# Altium schematic sheet [1]Shield.SchDoc
size A4; DocumentNumber: 2; SheetNumber: 2; SheetTotal: 4
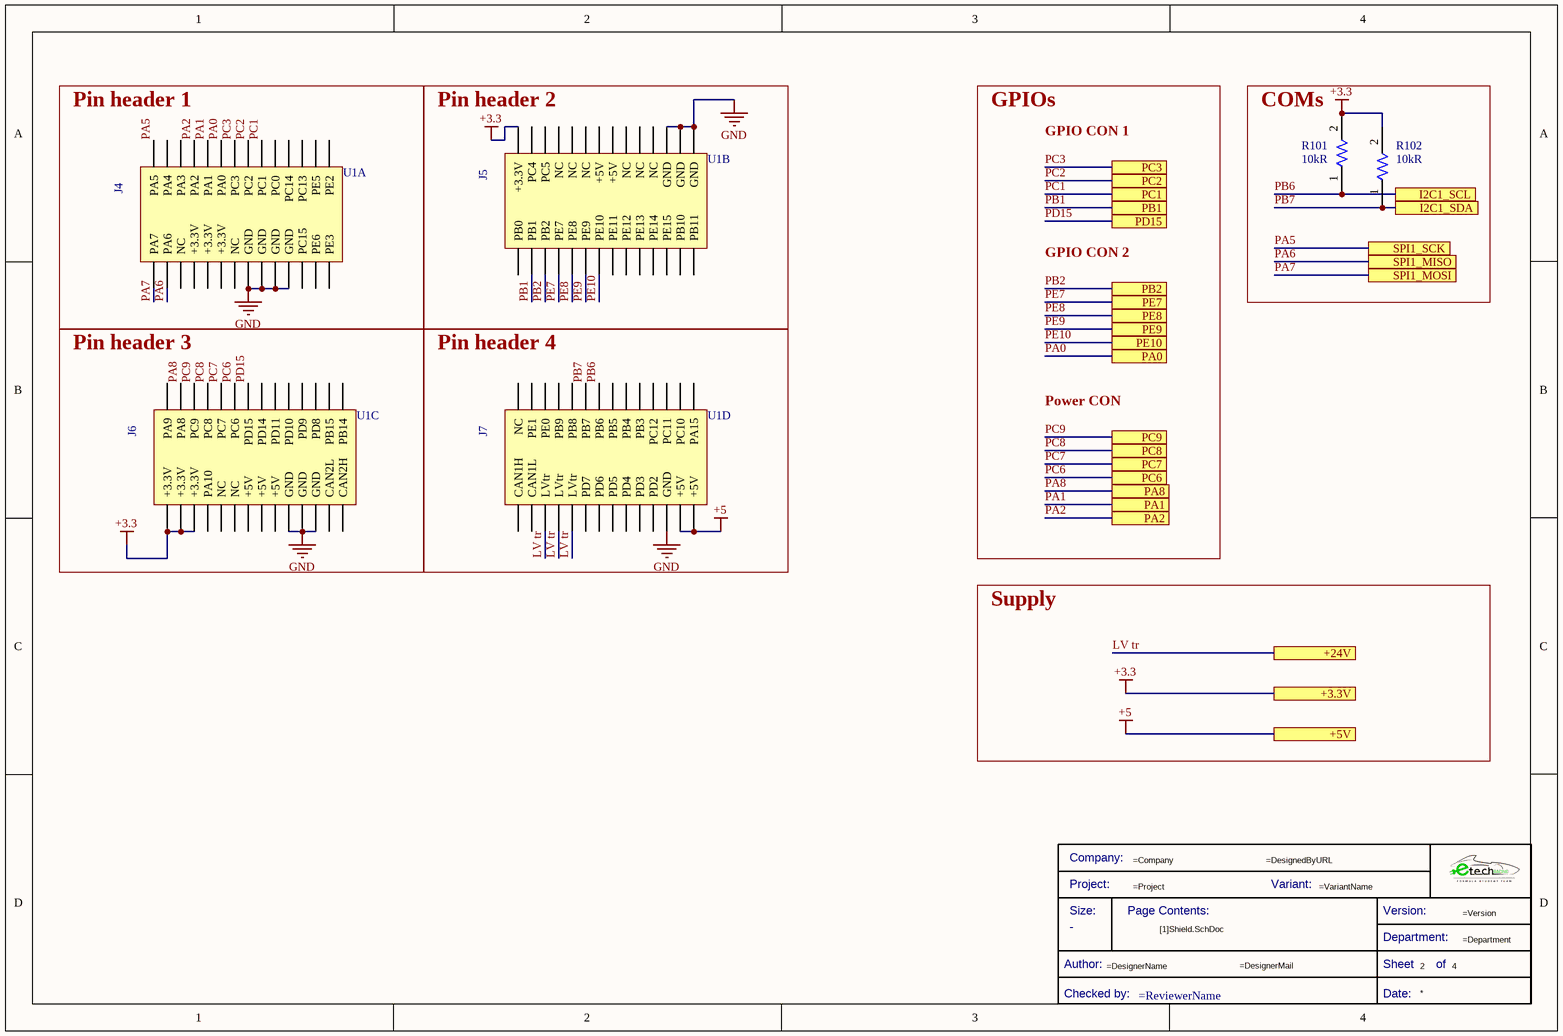
[diagram p0: [1]Shield.SchDoc]

## Parts
*  Title Block_template  (value not drawn)  (graphical)
R101  Resistance: 10kR  [R0805FTK]  (hidden comment: CR0805-JW-103ELF)
R102  Resistance: 10kR  [R0805FTK]  (hidden comment: CR0805-JW-103ELF)
U1  ETR_SHIELD_III  [ETR_SHIELD_III]  (value not drawn)  (parts A,B,C,D of 4)

## Blocks framed on the sheet
Pin header 1: U1
Pin header 2: U1
COMs: R101 R102
Pin header 3: U1
Pin header 4: U1

## Ports
+3.3V, +5V, +24V, I2C1_SCL, I2C1_SDA, PA0, PA1, PA2, PA8, PB1, PB2, PC1, PC2, PC3, PC6, PC7, PC8, PC9, PD15, PE7, PE8, PE9, PE10, SPI1_MISO, SPI1_MOSI, SPI1_SCK

## Nets
+3.3: R101.2 R102.2 U1.3V3_4(+3.3V) U1.3V3_5(+3.3V) U1.3V3_6(+3.3V) U1.3V3_7(+3.3V) ; port +3.3V
+5: U1.5V_6(+5V) U1.5V_7(+5V) ; port +5V
GND: U1.GND_1(GND) U1.GND_2(GND) U1.GND_3(GND) U1.GND_4(GND) U1.GND_5(GND) U1.GND_6(GND) U1.GND_7(GND) U1.GND_8(GND) U1.GND_9(GND) U1.GND_10(GND) U1.GND_11(GND)
LV tr: U1.LVtr_2(LVtr) U1.LVtr_3(LVtr) U1.LVtr_4(LVtr) ; port +24V
PA0: U1.PA0 ; port PA0
PA1: U1.PA1 ; port PA1
PA2: U1.PA2 ; port PA2
PA5: U1.PA5 ; port SPI1_SCK
PA6: U1.PA6 ; port SPI1_MISO
PA7: U1.PA7 ; port SPI1_MOSI
PA8: U1.PA8 ; port PA8
PB1: U1.PB1 ; port PB1
PB2: U1.PB2 ; port PB2
PB6: R101.1 U1.PB6 ; port I2C1_SCL
PB7: R102.1 U1.PB7 ; port I2C1_SDA
PC1: U1.PC1 ; port PC1
PC2: U1.PC2 ; port PC2
PC3: U1.PC3 ; port PC3
PC6: U1.PC6 ; port PC6
PC7: U1.PC7 ; port PC7
PC8: U1.PC8 ; port PC8
PC9: U1.PC9 ; port PC9
PD15: U1.PD15 ; port PD15
PE7: U1.PE7 ; port PE7
PE8: U1.PE8 ; port PE8
PE9: U1.PE9 ; port PE9
PE10: U1.PE10 ; port PE10

Not connected (* = marked no-connect by the designer): U1 3V3_1(+3.3V) 3V3_2(+3.3V) 3V3_3(+3.3V) 5V_1(+5V) 5V_2(+5V) 5V_3(+5V) 5V_4(+5V) 5V_5(+5V) CAN1_H(CAN1H) CAN1L CAN2H CAN2L NC_1(NC) NC_2(NC) NC_3(NC) NC_4(NC) NC_5(NC) NC_6(NC) NC_7(NC) NC_8(NC) NC_9(NC) NC_10(NC) NC_13(NC) PA3 PA4 PA9 PA10 PA15 PB0 PB3 PB4 PB5 PB8 PB9 PB10 PB11 PB14 PB15 PC0 PC4 PC5 PC10 PC11 PC12 PC13 PC14 PC15 PD2 PD3 PD4 PD5 PD6 PD7 PD8 PD9 PD10 PD11 PD14 PE0 PE1 PE2 PE3 PE5 PE6 PE11 PE12 PE13 PE14 PE15

## Notes on the sheet
- GPIOs
- GPIO CON 1
- GPIO CON 2
- Power CON
- Supply
- (in symbol ETR_Shield_III, part A) J4
- (in symbol ETR_Shield_III, part B) J5
- (in symbol ETR_Shield_III, part C) J6
- (in symbol ETR_Shield_III, part D) J7
- (in symbol Title Block_template) Company:; Project:; Variant:; Size:; Page Contents:; Version:; Department:; Author:; Sheet; of; Checked by:; Date:

## Library data of the parts
* = Title Block_template: Standard Title Block; .Creator: GP; Category: Title Block; .PCBcheck: GP; .SCHcheck: GP; Checked by:: =ReviewerName; Size: -
R101 R102 = R10k-0805FTK: BOURNS         CR0805-JW-103ELF            Surface Mount Chip Resistor, Thick Film, CR Series, 10 kohm, 125 mW,  5%, 150 V; Temperature Coefficient: 200ppm/°C; Power Rating: 125mW; Voltage Rating: 150V; Voltage Rating (DC): 100V; .Creator: DR; Supplier 1: Arrow Electronics; Manufacturer 1: Bourns; Manufacturer Part Number 1: CR0805-JW-103ELF; RoHS: Yes; Category: Chip SMD Resistors; Stock 1: 57566; Pricing 1: 1=0,05790, 10=0,01540, 25=0,01340, 100=0,00340 (USD); Mount: Surface Mount; Case/Package: 0805; Number of Pins: 2; Contact Plating: Tin; Case Code (Metric): 2012; Case Code (Imperial): 0805; Min Operating Temperature: -55°C; Max Operating Temperature: 155°C; Tolerance: 5%; Resistor Type: Thick Film; Package Quantity: 1; Packaging: Tape and Reel; Number of Terminations: 2; Termination: SMD/SMT; Max Power Dissipation: 125mW; Features: Moisture Resistant; Series: CR0805; Construction: Rectangular; Resistance Tolerance: 5%; Technology: THICK FILM; Length: 2mm; Width: 1.25mm; Height: 0.5mm; Depth: 1.25mm; Thickness: 508um; Radiation Hardening: No; REACH SVHC: No SVHC; Military Standard: Not; RoHS Compliant: Yes; ComponentLink1URL: https://datasheet.ciiva.com/11821/0900766b80fcdb72-11821135.pdf?src-supplier=RSComponents; ComponentLink1Description: https://datasheet.ciiva.com/11821/0900766b80fcdb72-11821135.pdf?src-supplier=RSComponents; ComponentLink2URL: https://datasheet.ciiva.com/9122/chpreztr-9122374.pdf?src-supplier=Avnet; ComponentLink2Description: https://datasheet.ciiva.com/9122/chpreztr-9122374.pdf?src-supplier=Avnet; ComponentLink3URL: https://datasheet.ciiva.com/22693/1902866-22693254.pdf?src-supplier=Element14; ComponentLink3Description: https://datasheet.ciiva.com/22693/1902866-22693254.pdf?src-supplier=Element14; ComponentLink4URL: https://datasheet.ciiva.com/7986/691949-7986187.pdf?src-supplier=Element14; ComponentLink4Description: https://datasheet.ciiva.com/7986/691949-7986187.pdf?src-supplier=Element14; ComponentLink5URL: https://datasheet.ciiva.com/30065/159chpreztr-30065976.pdf?src-supplier=Onlinecomponents.com; ComponentLink5Description: https://datasheet.ciiva.com/30065/159chpreztr-30065976.pdf?src-supplier=Onlinecomponents.com; ComponentLink6URL: https://datasheet.ciiva.com/16783/70154685-16783482.pdf?src-supplier=Allied+Electronics; ComponentLink6Description: https://datasheet.ciiva.com/16783/70154685-16783482.pdf?src-supplier=Allied+Electronics; ComponentLink7URL: https://datasheet.ciiva.com/5548/chpreztr-5548491.pdf?src-supplier=Mouser; ComponentLink7Description: https://datasheet.ciiva.com/5548/chpreztr-5548491.pdf?src-supplier=Mouser; ComponentLink8URL: https://datasheet.ciiva.com/6559/chpreztr-6559900.pdf?src-supplier=Digi-Key; ComponentLink8Description: https://datasheet.ciiva.com/6559/chpreztr-6559900.pdf?src-supplier=Digi-Key; ComponentLink9URL: https://datasheet.ciiva.com/6559/chpreztr-6559901.pdf?src-supplier=Digi-Key; ComponentLink9Description: https://datasheet.ciiva.com/6559/chpreztr-6559901.pdf?src-supplier=Digi-Key; ComponentLink10URL: https://datasheet.ciiva.com/7985/1856384-7985869.pdf?src-supplier=Element14; ComponentLink10Description: https://datasheet.ciiva.com/7985/1856384-7985869.pdf?src-supplier=Element14; ComponentLink11URL: https://datasheet.ciiva.com/48692/001055517-da-01-en-smd-wid-cr0805-jw-103elf-10k-ohm-1-8w-48692118.pdf?src-supplier=Conrad; ComponentLink11Description: https://datasheet.ciiva.com/48692/001055517-da-01-en-smd-wid-cr0805-jw-103elf-10k-ohm-1-8w-48692118.pdf?src-supplier=Conrad; Supplier Part Number 1: CR0805-JW-103ELF